# Altium schematic sheet power.SchDoc
size A4
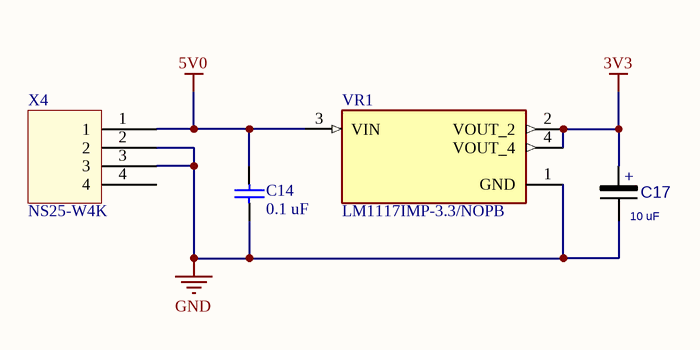
[diagram p0: power.SchDoc]

## Parts
C14  0.1 uF  [0805 chip cap]
C17  10 uF  [CAP CASE-A]
VR1  LM1117IMP-3.3/NOPB  [VREG_LM1117IMP-3.3/NOPB]
X4  NS25-W4K  [NS25-W4K]

## Nets
3V3: C17.1 VR1.2(VOUT_2) VR1.4(VOUT_4)
5V0: C14.2 VR1.3(VIN) X4.1
GND: C14.1 C17.2 VR1.1(GND) X4.2 X4.3

Not connected (* = marked no-connect by the designer): X4 4

## Notes on the sheet
- (in symbol CAP POL CASE A) +

## Library data of the parts
C14 = Cap: Capacitor; Value: 0.1 uF
C17 = CAP POL CASE A: Value: 10 uF
VR1 = LM1117IMP-3.3/NOPB: 800-mA 15-V linear voltage regulator 4-SOT-223 0 to 125; Price: None; Package: None; Availability: Unavailable; MP: LM1117IMP-3.3/NOPB; Value: *